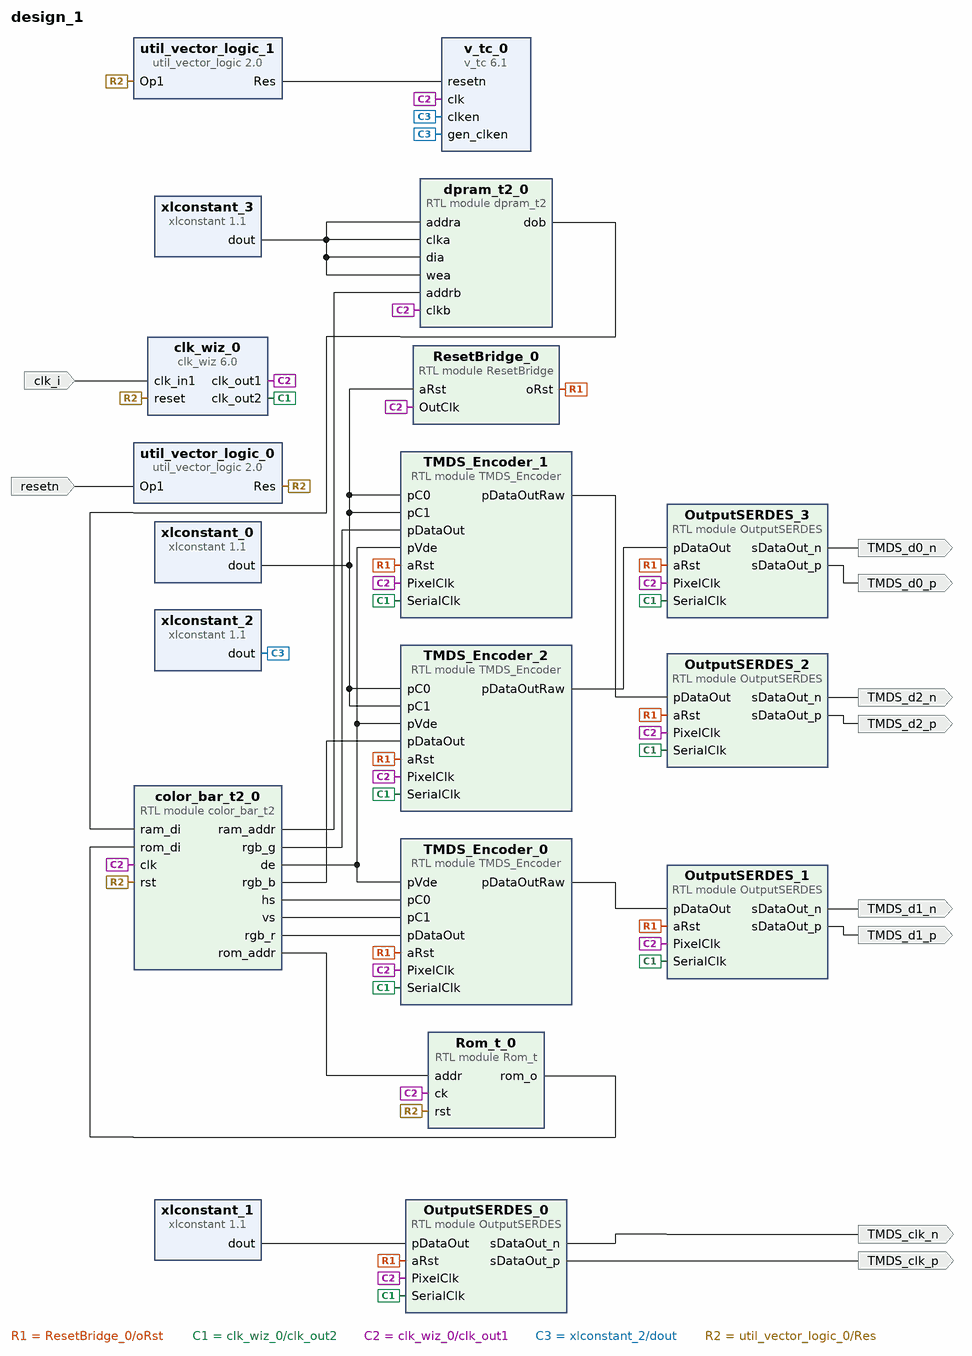
[diagram p0: block diagram of the top level]
# Vivado block design design_1, xc7a100tlfgg676-2L, Vivado 2019.1
create_bd_design design_1

create_bd_port -dir I clk_i
create_bd_port -dir I -type rst resetn
set_property -dict {CONFIG.POLARITY ACTIVE_HIGH} [get_bd_ports resetn]
create_bd_port -dir O TMDS_clk_p
create_bd_port -dir O TMDS_clk_n
create_bd_port -dir O TMDS_d1_p
create_bd_port -dir O TMDS_d1_n
create_bd_port -dir O TMDS_d2_p
create_bd_port -dir O TMDS_d2_n
create_bd_port -dir O TMDS_d0_p
create_bd_port -dir O TMDS_d0_n

create_bd_cell -type module -reference OutputSERDES OutputSERDES_0
create_bd_cell -type module -reference OutputSERDES OutputSERDES_1
create_bd_cell -type module -reference TMDS_Encoder TMDS_Encoder_0
create_bd_cell -type module -reference OutputSERDES OutputSERDES_2
create_bd_cell -type module -reference TMDS_Encoder TMDS_Encoder_1
create_bd_cell -type module -reference OutputSERDES OutputSERDES_3
create_bd_cell -type module -reference TMDS_Encoder TMDS_Encoder_2
create_bd_cell -type ip -vlnv xilinx.com:ip:xlconstant:1.1 xlconstant_0
set_property -dict {CONFIG.CONST_VAL 0} [get_bd_cells xlconstant_0]
create_bd_cell -type module -reference ResetBridge ResetBridge_0
create_bd_cell -type ip -vlnv xilinx.com:ip:xlconstant:1.1 xlconstant_1
set_property -dict {CONFIG.CONST_VAL b1111100000 CONFIG.CONST_WIDTH 10} [get_bd_cells xlconstant_1]
create_bd_cell -type ip -vlnv xilinx.com:ip:clk_wiz:6.0 clk_wiz_0
set_property -dict [list \
  CONFIG.CLKIN1_JITTER_PS 200.0 \
  CONFIG.CLKOUT1_JITTER 176.933 \
  CONFIG.CLKOUT1_PHASE_ERROR 139.020 \
  CONFIG.CLKOUT1_REQUESTED_OUT_FREQ 150.000 \
  CONFIG.CLKOUT2_JITTER 134.087 \
  CONFIG.CLKOUT2_PHASE_ERROR 139.020 \
  CONFIG.CLKOUT2_REQUESTED_OUT_FREQ 750.000 \
  CONFIG.CLKOUT2_USED true \
  CONFIG.MMCM_CLKFBOUT_MULT_F 15.000 \
  CONFIG.MMCM_CLKIN1_PERIOD 20.000 \
  CONFIG.MMCM_CLKIN2_PERIOD 10.0 \
  CONFIG.MMCM_CLKOUT0_DIVIDE_F 5.000 \
  CONFIG.MMCM_CLKOUT1_DIVIDE 1 \
  CONFIG.NUM_OUT_CLKS 2 \
  CONFIG.PRIM_IN_FREQ 50.000 \
] [get_bd_cells clk_wiz_0]
create_bd_cell -type ip -vlnv xilinx.com:ip:v_tc:6.1 v_tc_0
set_property -dict [list \
  CONFIG.FSYNC_HSTART0 20 \
  CONFIG.FSYNC_HSTART1 30 \
  CONFIG.FSYNC_HSTART2 40 \
  CONFIG.FSYNC_HSTART3 50 \
  CONFIG.FSYNC_VSTART1 0 \
  CONFIG.FSYNC_VSTART2 0 \
  CONFIG.FSYNC_VSTART3 0 \
  CONFIG.HAS_AXI4_LITE false \
  CONFIG.VIDEO_MODE 800x600p \
  CONFIG.enable_detection false \
  CONFIG.frame_syncs 4 \
] [get_bd_cells v_tc_0]
create_bd_cell -type ip -vlnv xilinx.com:ip:xlconstant:1.1 xlconstant_2
create_bd_cell -type ip -vlnv xilinx.com:ip:util_vector_logic:2.0 util_vector_logic_1
set_property -dict {CONFIG.C_OPERATION not CONFIG.C_SIZE 1} [get_bd_cells util_vector_logic_1]
create_bd_cell -type ip -vlnv xilinx.com:ip:util_vector_logic:2.0 util_vector_logic_0
set_property -dict {CONFIG.C_OPERATION not CONFIG.C_SIZE 1} [get_bd_cells util_vector_logic_0]
create_bd_cell -type module -reference Rom_t Rom_t_0
create_bd_cell -type ip -vlnv xilinx.com:ip:xlconstant:1.1 xlconstant_3
set_property -dict {CONFIG.CONST_VAL 0} [get_bd_cells xlconstant_3]
create_bd_cell -type module -reference dpram_t2 dpram_t2_0
create_bd_cell -type module -reference color_bar_t2 color_bar_t2_0

# ---- connections ----

connect_bd_net [get_bd_pins TMDS_Encoder_0/pDataOutRaw] [get_bd_pins OutputSERDES_1/pDataOut]
connect_bd_net [get_bd_pins TMDS_Encoder_1/pDataOutRaw] [get_bd_pins OutputSERDES_2/pDataOut]
connect_bd_net [get_bd_pins TMDS_Encoder_2/pDataOutRaw] [get_bd_pins OutputSERDES_3/pDataOut]
connect_bd_net [get_bd_pins ResetBridge_0/oRst] \
  [get_bd_pins TMDS_Encoder_1/aRst] [get_bd_pins TMDS_Encoder_2/aRst] [get_bd_pins TMDS_Encoder_0/aRst] \
  [get_bd_pins OutputSERDES_2/aRst] [get_bd_pins OutputSERDES_1/aRst] [get_bd_pins OutputSERDES_0/aRst] \
  [get_bd_pins OutputSERDES_3/aRst]
connect_bd_net -net ClockGen_0_SerialClk [get_bd_pins clk_wiz_0/clk_out2] \
  [get_bd_pins OutputSERDES_0/SerialClk] [get_bd_pins OutputSERDES_1/SerialClk] [get_bd_pins OutputSERDES_2/SerialClk] \
  [get_bd_pins OutputSERDES_3/SerialClk] [get_bd_pins TMDS_Encoder_0/SerialClk] [get_bd_pins TMDS_Encoder_1/SerialClk] \
  [get_bd_pins TMDS_Encoder_2/SerialClk]
connect_bd_net -net ClockGen_0_PixelClkOut [get_bd_pins clk_wiz_0/clk_out1] \
  [get_bd_pins OutputSERDES_0/PixelClk] [get_bd_pins OutputSERDES_1/PixelClk] [get_bd_pins OutputSERDES_2/PixelClk] \
  [get_bd_pins OutputSERDES_3/PixelClk] [get_bd_pins TMDS_Encoder_0/PixelClk] [get_bd_pins TMDS_Encoder_1/PixelClk] \
  [get_bd_pins TMDS_Encoder_2/PixelClk] [get_bd_pins ResetBridge_0/OutClk] [get_bd_pins v_tc_0/clk] [get_bd_pins Rom_t_0/ck] \
  [get_bd_pins dpram_t2_0/clkb] [get_bd_pins color_bar_t2_0/clk]
connect_bd_net [get_bd_pins xlconstant_1/dout] [get_bd_pins OutputSERDES_0/pDataOut]
connect_bd_net [get_bd_pins OutputSERDES_0/sDataOut_p] [get_bd_ports TMDS_clk_p]
connect_bd_net [get_bd_pins OutputSERDES_0/sDataOut_n] [get_bd_ports TMDS_clk_n]
connect_bd_net [get_bd_pins OutputSERDES_1/sDataOut_p] [get_bd_ports TMDS_d1_p]
connect_bd_net [get_bd_pins OutputSERDES_1/sDataOut_n] [get_bd_ports TMDS_d1_n]
connect_bd_net [get_bd_pins OutputSERDES_2/sDataOut_p] [get_bd_ports TMDS_d2_p]
connect_bd_net [get_bd_pins OutputSERDES_2/sDataOut_n] [get_bd_ports TMDS_d2_n]
connect_bd_net [get_bd_pins OutputSERDES_3/sDataOut_p] [get_bd_ports TMDS_d0_p]
connect_bd_net [get_bd_pins OutputSERDES_3/sDataOut_n] [get_bd_ports TMDS_d0_n]
connect_bd_net [get_bd_pins xlconstant_0/dout] \
  [get_bd_pins TMDS_Encoder_1/pC0] [get_bd_pins TMDS_Encoder_1/pC1] [get_bd_pins TMDS_Encoder_2/pC0] \
  [get_bd_pins TMDS_Encoder_2/pC1] [get_bd_pins ResetBridge_0/aRst]
connect_bd_net [get_bd_pins xlconstant_2/dout] [get_bd_pins v_tc_0/clken] [get_bd_pins v_tc_0/gen_clken]
connect_bd_net [get_bd_ports clk_i] [get_bd_pins clk_wiz_0/clk_in1]
connect_bd_net [get_bd_ports resetn] [get_bd_pins util_vector_logic_0/Op1]
connect_bd_net [get_bd_pins util_vector_logic_0/Res] \
  [get_bd_pins util_vector_logic_1/Op1] [get_bd_pins clk_wiz_0/reset] [get_bd_pins Rom_t_0/rst] \
  [get_bd_pins color_bar_t2_0/rst]
connect_bd_net [get_bd_pins color_bar_t2_0/hs] [get_bd_pins TMDS_Encoder_0/pC0]
connect_bd_net [get_bd_pins color_bar_t2_0/vs] [get_bd_pins TMDS_Encoder_0/pC1]
connect_bd_net [get_bd_pins color_bar_t2_0/de] [get_bd_pins TMDS_Encoder_0/pVde] [get_bd_pins TMDS_Encoder_1/pVde] [get_bd_pins TMDS_Encoder_2/pVde]
connect_bd_net [get_bd_pins color_bar_t2_0/rgb_r] [get_bd_pins TMDS_Encoder_0/pDataOut]
connect_bd_net [get_bd_pins color_bar_t2_0/rgb_g] [get_bd_pins TMDS_Encoder_1/pDataOut]
connect_bd_net [get_bd_pins color_bar_t2_0/rgb_b] [get_bd_pins TMDS_Encoder_2/pDataOut]
connect_bd_net [get_bd_pins util_vector_logic_1/Res] [get_bd_pins v_tc_0/resetn]
connect_bd_net [get_bd_pins color_bar_t2_0/ram_addr] [get_bd_pins dpram_t2_0/addrb]
connect_bd_net [get_bd_pins color_bar_t2_0/rom_addr] [get_bd_pins Rom_t_0/addr]
connect_bd_net [get_bd_pins dpram_t2_0/dob] [get_bd_pins color_bar_t2_0/ram_di]
connect_bd_net [get_bd_pins xlconstant_3/dout] \
  [get_bd_pins dpram_t2_0/clka] [get_bd_pins dpram_t2_0/wea] [get_bd_pins dpram_t2_0/addra] [get_bd_pins dpram_t2_0/dia]
connect_bd_net [get_bd_pins Rom_t_0/rom_o] [get_bd_pins color_bar_t2_0/rom_di]

validate_bd_design
save_bd_design
